# Altium schematic sheet Stag12.SchDoc
size 594 x 420 mm
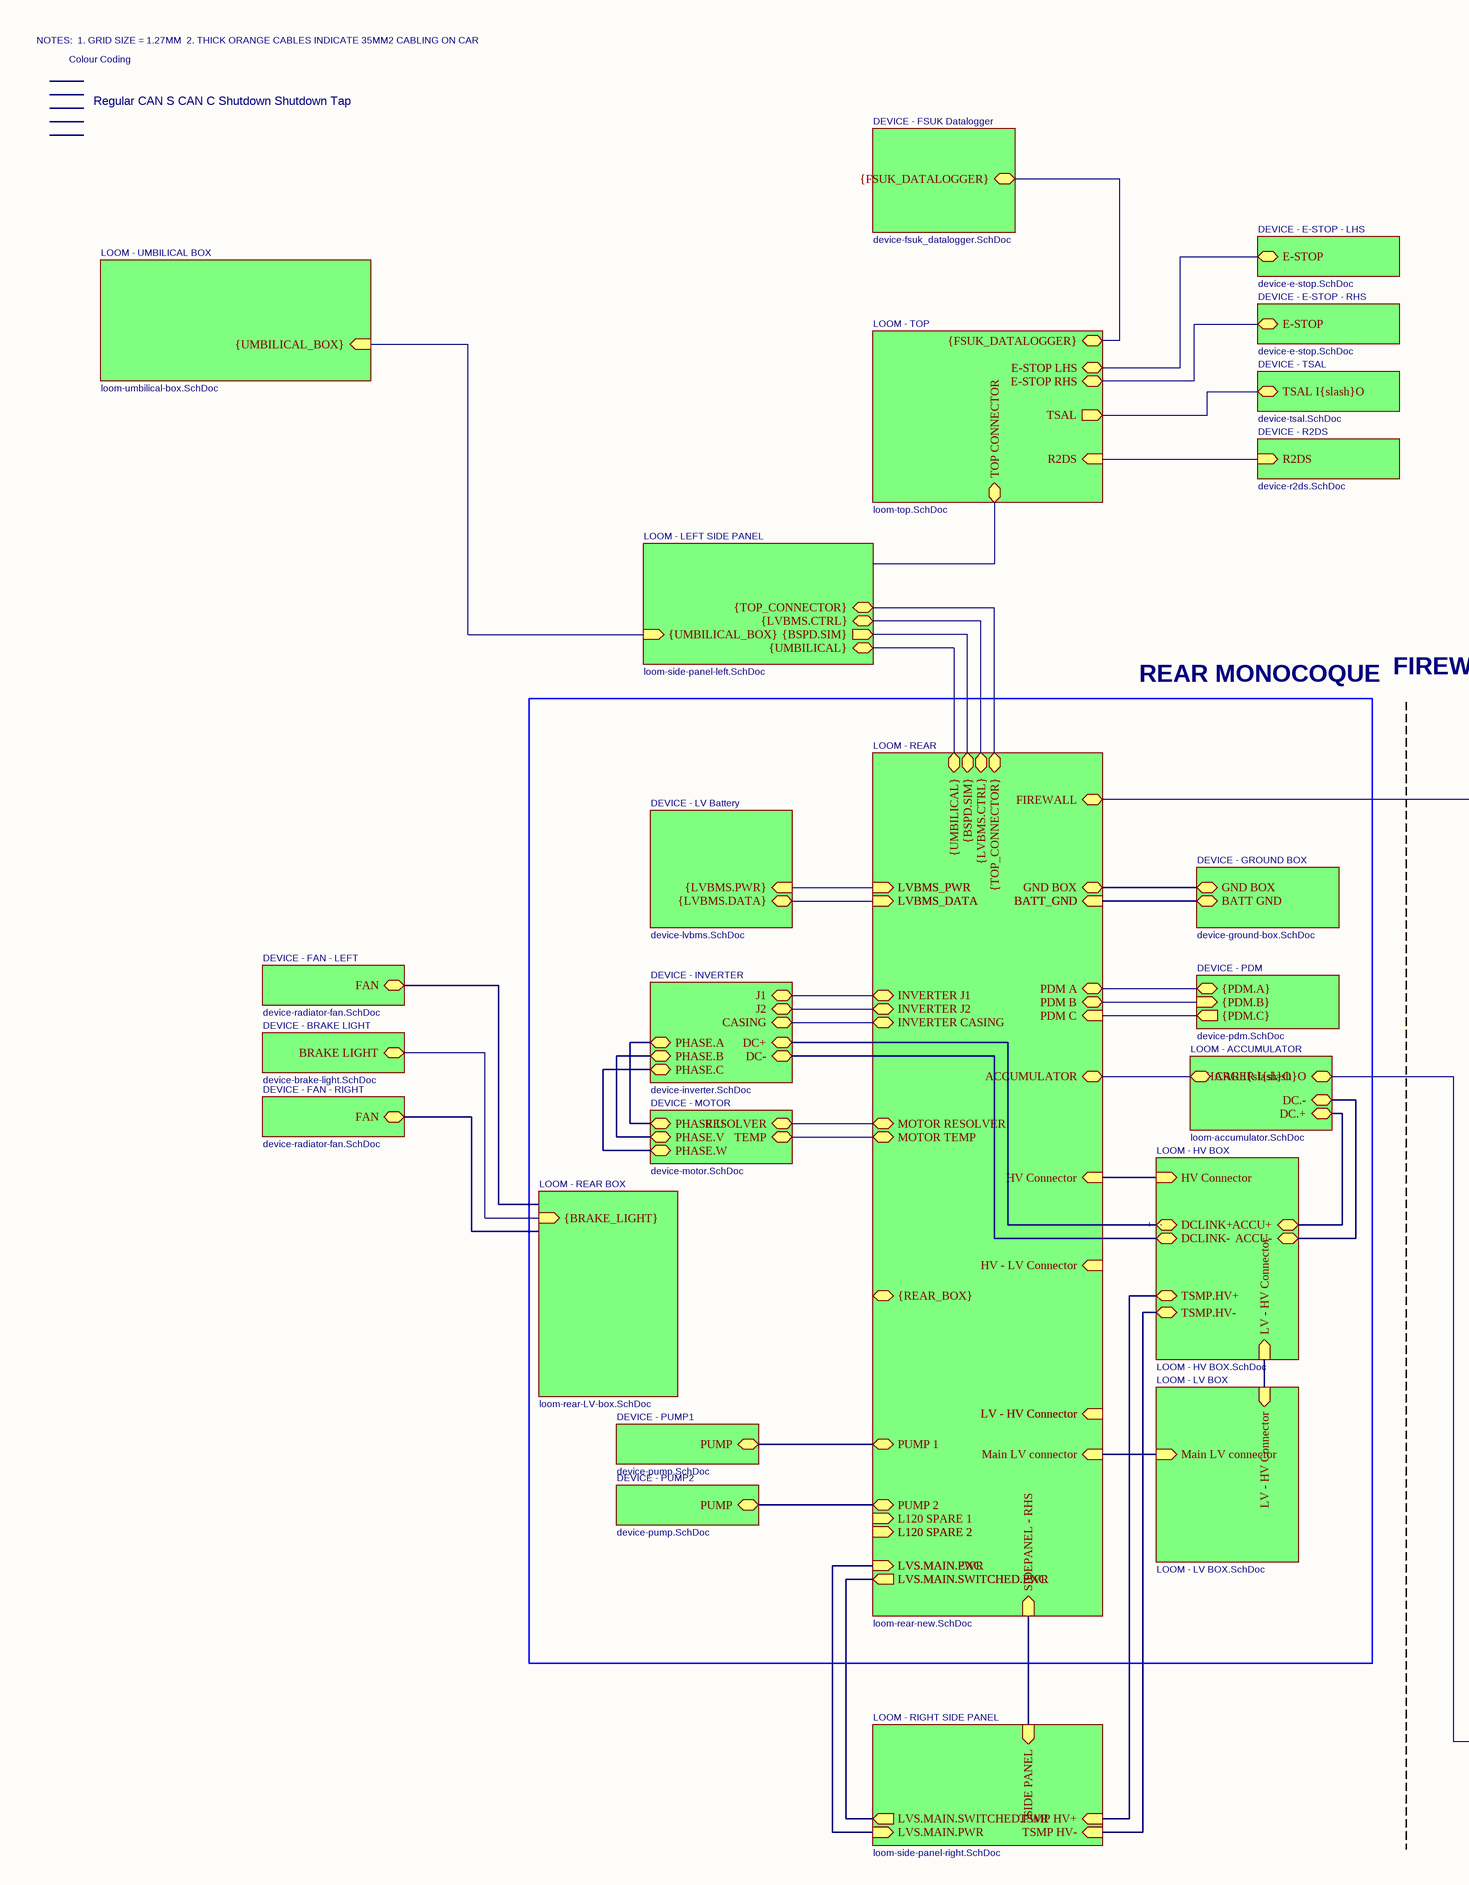
[diagram p0: Stag12.SchDoc, left]
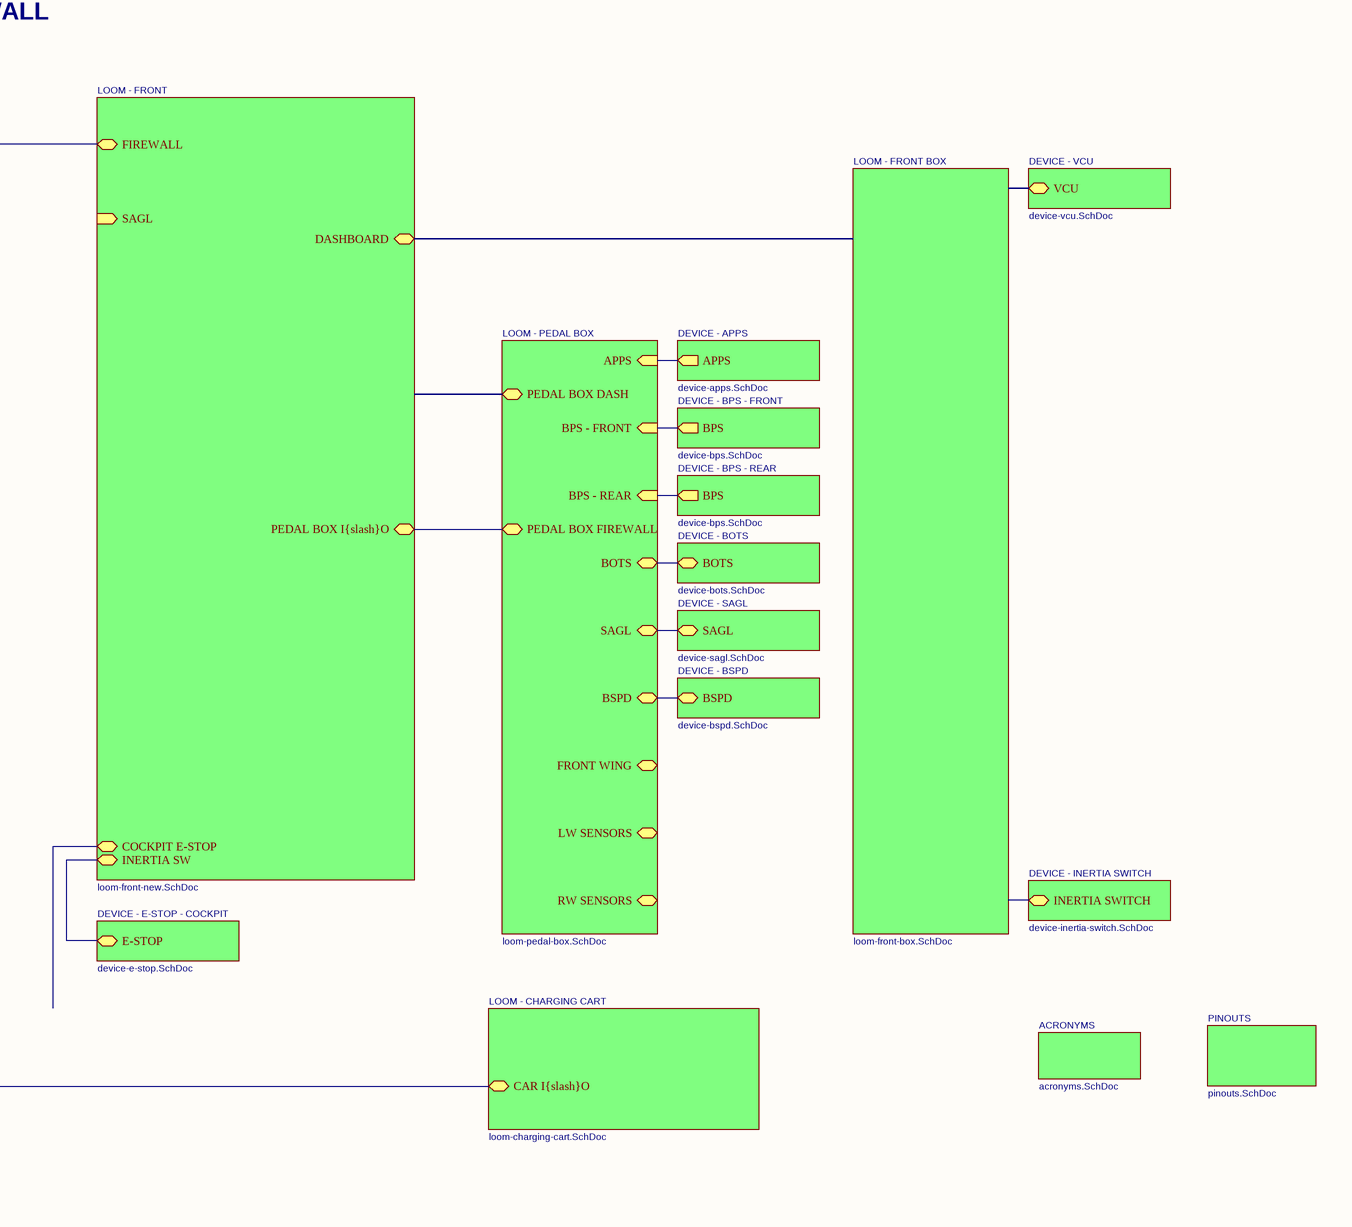
[diagram p1: Stag12.SchDoc, right]

## Sub-sheets
ACRONYMS = acronyms.SchDoc: no entries
DEVICE - APPS = device-apps.SchDoc: APPS (out)
DEVICE - BOTS = device-bots.SchDoc: BOTS (bidir)
DEVICE - BPS - FRONT = device-bps.SchDoc: BPS (out)
DEVICE - BPS - REAR = device-bps.SchDoc: BPS (out)
DEVICE - BRAKE LIGHT = device-brake-light.SchDoc: BRAKE LIGHT (bidir)
DEVICE - BSPD = device-bspd.SchDoc: BSPD (bidir)
DEVICE - E-STOP - COCKPIT = device-e-stop.SchDoc: E-STOP (bidir)
DEVICE - E-STOP - LHS = device-e-stop.SchDoc: E-STOP (bidir)
DEVICE - E-STOP - RHS = device-e-stop.SchDoc: E-STOP (bidir)
DEVICE - FAN - LEFT = device-radiator-fan.SchDoc: FAN (bidir)
DEVICE - FAN - RIGHT = device-radiator-fan.SchDoc: FAN (bidir)
DEVICE - FSUK Datalogger = device-fsuk_datalogger.SchDoc: {FSUK_DATALOGGER} (bidir)
DEVICE - GROUND BOX = device-ground-box.SchDoc: GND BOX (bidir), BATT GND (bidir)
DEVICE - INERTIA SWITCH = device-inertia-switch.SchDoc: INERTIA SWITCH (bidir)
DEVICE - INVERTER = device-inverter.SchDoc: PHASE.A (bidir), PHASE.B (bidir), PHASE.C (bidir), J1 (bidir), J2 (bidir), CASING (bidir), DC+ (bidir), DC- (bidir)
DEVICE - LV Battery = device-lvbms.SchDoc: {LVBMS.PWR} (in), {LVBMS.DATA} (bidir)
DEVICE - MOTOR = device-motor.SchDoc: PHASE.V (bidir), PHASE.U (bidir), PHASE.W (bidir), RESOLVER (bidir), TEMP (bidir)
DEVICE - PDM = device-pdm.SchDoc: {PDM.A} (bidir), {PDM.B} (in), {PDM.C} (out)
DEVICE - PUMP1 = device-pump.SchDoc: PUMP (bidir)
DEVICE - PUMP2 = device-pump.SchDoc: PUMP (bidir)
DEVICE - R2DS = device-r2ds.SchDoc: R2DS (in)
DEVICE - SAGL = device-sagl.SchDoc: SAGL (bidir)
DEVICE - TSAL = device-tsal.SchDoc: TSAL I{slash}O (bidir)
DEVICE - VCU = device-vcu.SchDoc: VCU (bidir)
LOOM - ACCUMULATOR = loom-accumulator.SchDoc: CHARGER I{slash}O (bidir), CAR I{slash}O (bidir), DC.- (bidir), DC.+ (bidir)
LOOM - CHARGING CART = loom-charging-cart.SchDoc: CAR I{slash}O (bidir)
LOOM - FRONT = loom-front-new.SchDoc: DASHBOARD (bidir), FIREWALL (bidir), PEDAL BOX I{slash}O (bidir), SAGL (in), COCKPIT E-STOP (bidir), INERTIA SW (bidir)
LOOM - FRONT BOX = loom-front-box.SchDoc: no entries
LOOM - HV BOX = LOOM - HV BOX.SchDoc: TSMP.HV- (bidir), TSMP.HV+ (bidir), LV - HV Connector (in), HV Connector (in), ACCU+ (bidir), ACCU- (bidir), DCLINK+ (bidir), DCLINK- (bidir)
LOOM - LEFT SIDE PANEL = loom-side-panel-left.SchDoc: {UMBILICAL} (bidir), {LVBMS.CTRL} (bidir), {UMBILICAL_BOX} (in), {BSPD.SIM} (out), {TOP_CONNECTOR} (bidir)
LOOM - LV BOX = LOOM - LV BOX.SchDoc: Main LV connector (in), LV - HV Connector (in)
LOOM - PEDAL BOX = loom-pedal-box.SchDoc: APPS (in), BPS - FRONT (in), BPS - REAR (in), BOTS (bidir), SAGL (bidir), BSPD (bidir), FRONT WING (bidir), LW SENSORS (bidir), PEDAL BOX DASH (bidir), PEDAL BOX FIREWALL (bidir), RW SENSORS (bidir)
LOOM - REAR = loom-rear-new.SchDoc: {UMBILICAL} (bidir), GND BOX (bidir), SIDEPANEL - RHS (in), PDM A (bidir), PDM B (bidir), Main LV connector (in), HV Connector (in), ACCUMULATOR (bidir), FIREWALL (bidir), INVERTER J2 (bidir), INVERTER J1 (bidir), MOTOR RESOLVER (bidir), INVERTER CASING (bidir), MOTOR TEMP (bidir), PUMP 1 (bidir), PUMP 2 (bidir), HV - LV Connector (in), L120 SPARE 1 (in), L120 SPARE 2 (in), LV - HV Connector (in), LVS.MAIN.PWR (in), LVS.MAIN.SWITCHED.PWR (out), BATT_GND (in), LVBMS_DATA (in), LVBMS_PWR (in), L120 SPARE 2 (in), LV - HV Connector (in), LVS.MAIN.EXC (in), LVS.MAIN.SWITCHED.EXC (out), BATT_GND (in), LVBMS_DATA (in), LVBMS_PWR (in), {BSPD.SIM} (bidir), {LVBMS.CTRL} (bidir), PDM C (in), {REAR_BOX} (bidir), {TOP_CONNECTOR} (bidir)
LOOM - REAR BOX = loom-rear-LV-box.SchDoc: {BRAKE_LIGHT} (in)
LOOM - RIGHT SIDE PANEL = loom-side-panel-right.SchDoc: LVS.MAIN.PWR (in), TSMP HV- (in), TSMP HV+ (in), SIDE PANEL (in), LVS.MAIN.SWITCHED.PWR (out)
LOOM - TOP = loom-top.SchDoc: TOP CONNECTOR (bidir), TSAL (out), {FSUK_DATALOGGER} (bidir), E-STOP LHS (bidir), E-STOP RHS (bidir), R2DS (in)
LOOM - UMBILICAL BOX = loom-umbilical-box.SchDoc: {UMBILICAL_BOX} (in)
PINOUTS = pinouts.SchDoc: no entries

## Nets
(unnamed): sheet DEVICE - PUMP2/PUMP, sheet LOOM - REAR/PUMP 2
(unnamed): sheet DEVICE - INVERTER/PHASE.A, sheet DEVICE - MOTOR/PHASE.U
(unnamed): sheet DEVICE - INVERTER/PHASE.B, sheet DEVICE - MOTOR/PHASE.V
(unnamed): sheet DEVICE - INVERTER/PHASE.C, sheet DEVICE - MOTOR/PHASE.W
(unnamed): sheet DEVICE - INVERTER/DC+, sheet LOOM - HV BOX/DCLINK+
(unnamed): sheet DEVICE - INVERTER/DC-, sheet LOOM - HV BOX/DCLINK-
(unnamed): sheet DEVICE - PUMP1/PUMP, sheet LOOM - REAR/PUMP 1
(unnamed): sheet LOOM - LV BOX/Main LV connector, sheet LOOM - REAR/Main LV connector
(unnamed): sheet LOOM - LV BOX/LV - HV Connector, sheet LOOM - HV BOX/LV - HV Connector
(unnamed): sheet LOOM - HV BOX/TSMP.HV-, sheet LOOM - RIGHT SIDE PANEL/TSMP HV-
(unnamed): sheet LOOM - HV BOX/TSMP.HV+, sheet LOOM - RIGHT SIDE PANEL/TSMP HV+
(unnamed): sheet LOOM - HV BOX/HV Connector, sheet LOOM - REAR/HV Connector
(unnamed): sheet LOOM - HV BOX/ACCU+, sheet LOOM - ACCUMULATOR/DC.+
(unnamed): sheet LOOM - HV BOX/ACCU-, sheet LOOM - ACCUMULATOR/DC.-
(unnamed): sheet LOOM - RIGHT SIDE PANEL/LVS.MAIN.PWR, sheet LOOM - REAR/LVS.MAIN.PWR, sheet LOOM - REAR/LVS.MAIN.EXC
(unnamed): sheet LOOM - RIGHT SIDE PANEL/SIDE PANEL, sheet LOOM - REAR/SIDEPANEL - RHS
(unnamed): sheet LOOM - RIGHT SIDE PANEL/LVS.MAIN.SWITCHED.PWR, sheet LOOM - REAR/LVS.MAIN.SWITCHED.PWR, sheet LOOM - REAR/LVS.MAIN.SWITCHED.EXC
(unnamed): sheet DEVICE - GROUND BOX/GND BOX, sheet LOOM - REAR/GND BOX
(unnamed): sheet DEVICE - GROUND BOX/BATT GND, sheet LOOM - REAR/BATT_GND, sheet LOOM - REAR/BATT_GND
(unnamed): sheet LOOM - REAR/L120 SPARE 2, sheet LOOM - REAR/L120 SPARE 2
(unnamed): sheet LOOM - REAR/LV - HV Connector, sheet LOOM - REAR/LV - HV Connector

## Buses and harness runs
bus sheet DEVICE - APPS/APPS = sheet LOOM - PEDAL BOX/APPS
bus sheet DEVICE - BOTS/BOTS = sheet LOOM - PEDAL BOX/BOTS
bus sheet DEVICE - BPS - FRONT/BPS = sheet LOOM - PEDAL BOX/BPS - FRONT
bus sheet DEVICE - BPS - REAR/BPS = sheet LOOM - PEDAL BOX/BPS - REAR
bus sheet DEVICE - BRAKE LIGHT/BRAKE LIGHT = sheet LOOM - REAR BOX/{BRAKE_LIGHT}
bus sheet DEVICE - BSPD/BSPD = sheet LOOM - PEDAL BOX/BSPD
bus sheet DEVICE - E-STOP - COCKPIT/E-STOP = sheet LOOM - FRONT/INERTIA SW
bus sheet DEVICE - E-STOP - LHS/E-STOP = sheet LOOM - TOP/E-STOP LHS
bus sheet DEVICE - E-STOP - RHS/E-STOP = sheet LOOM - TOP/E-STOP RHS
bus sheet DEVICE - FSUK Datalogger/{FSUK_DATALOGGER} = sheet LOOM - TOP/{FSUK_DATALOGGER}
bus sheet DEVICE - INVERTER/CASING = sheet LOOM - REAR/INVERTER CASING
bus sheet DEVICE - INVERTER/J1 = sheet LOOM - REAR/INVERTER J1
bus sheet DEVICE - INVERTER/J2 = sheet LOOM - REAR/INVERTER J2
bus sheet DEVICE - LV Battery/{LVBMS.DATA} = sheet LOOM - REAR/LVBMS_DATA
bus sheet DEVICE - LV Battery/{LVBMS.PWR} = sheet LOOM - REAR/LVBMS_PWR
bus sheet DEVICE - MOTOR/RESOLVER = sheet LOOM - REAR/MOTOR RESOLVER
bus sheet DEVICE - MOTOR/TEMP = sheet LOOM - REAR/MOTOR TEMP
bus sheet DEVICE - PDM/{PDM.A} = sheet LOOM - REAR/PDM A
bus sheet DEVICE - PDM/{PDM.B} = sheet LOOM - REAR/PDM B
bus sheet DEVICE - PDM/{PDM.C} = sheet LOOM - REAR/PDM C
bus sheet DEVICE - R2DS/R2DS = sheet LOOM - TOP/R2DS
bus sheet DEVICE - SAGL/SAGL = sheet LOOM - PEDAL BOX/SAGL
bus sheet DEVICE - TSAL/TSAL I{slash}O = sheet LOOM - TOP/TSAL
bus sheet LOOM - ACCUMULATOR/CAR I{slash}O = sheet LOOM - REAR/ACCUMULATOR
bus sheet LOOM - ACCUMULATOR/CHARGER I{slash}O = sheet LOOM - CHARGING CART/CAR I{slash}O
bus sheet LOOM - FRONT/FIREWALL = sheet LOOM - REAR/FIREWALL
bus sheet LOOM - FRONT/PEDAL BOX I{slash}O = sheet LOOM - PEDAL BOX/PEDAL BOX FIREWALL
bus sheet LOOM - LEFT SIDE PANEL/{BSPD.SIM} = sheet LOOM - REAR/{BSPD.SIM}
bus sheet LOOM - LEFT SIDE PANEL/{LVBMS.CTRL} = sheet LOOM - REAR/{LVBMS.CTRL}
bus sheet LOOM - LEFT SIDE PANEL/{TOP_CONNECTOR} = sheet LOOM - REAR/{TOP_CONNECTOR}
bus sheet LOOM - LEFT SIDE PANEL/{UMBILICAL_BOX} = sheet LOOM - UMBILICAL BOX/{UMBILICAL_BOX}
bus sheet LOOM - LEFT SIDE PANEL/{UMBILICAL} = sheet LOOM - REAR/{UMBILICAL}

## Notes on the sheet
- NOTES:
  1. GRID SIZE = 1.27MM
  2. THICK ORANGE CABLES INDICATE 35MM2 CABLING ON CAR
- Colour Coding
- Regular
  CAN S
  CAN C
  Shutdown
  Shutdown Tap
- REAR MONOCOQUE
- FIREWALL
- +
  -
- 1
- 2
- 3
- 4
- 5
- 6
- 7
- 8
- 9
- 10
- 11
- A
- B
- C
- D
- E
- F
- G
- H
- Title: STAG 12 - TOP LEVEL
- File: Stag12.kicad_sch
- Sheet: /
- KiCad E.D.A.  kicad (5.1.4)-1
- Size: A2
- Date:
- Rev:
- Id: 1/1